# Altium schematic sheet Sheet1.SchDoc
size A4; SheetNumber: 1; SheetTotal: 1
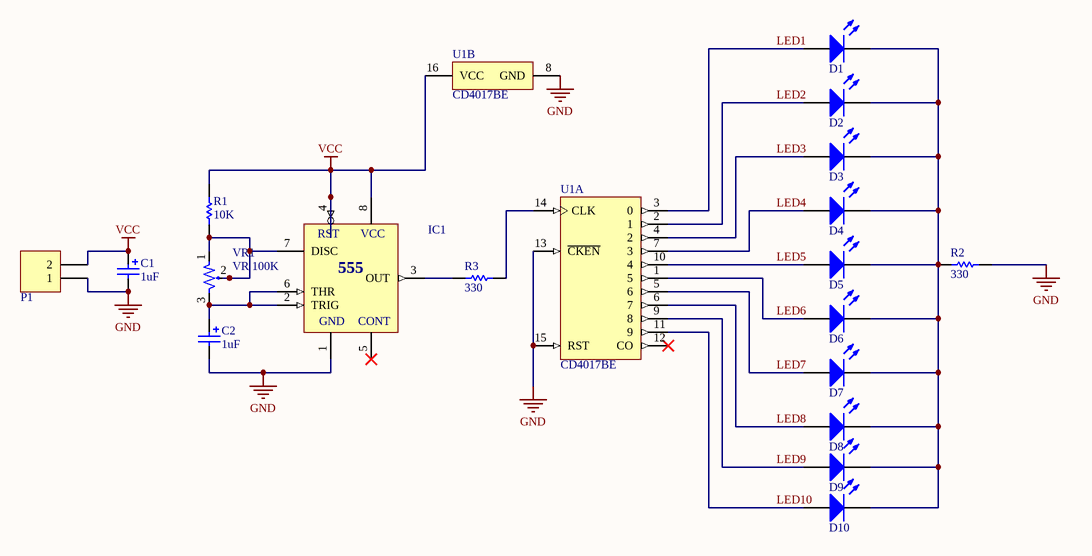
[diagram p0: Sheet1.SchDoc]

## Parts
C1  value 1uF  [CP1/2]  (hidden comment: Cap Pol)
C2  value 1uF  [CP1/2]  (hidden comment: Cap Pol)
D1  LED  [LED-5mm]  (value not drawn)
D2  LED  [LED-5mm]  (value not drawn)
D3  LED  [LED-5mm]  (value not drawn)
D4  LED  [LED-5mm]  (value not drawn)
D5  LED  [LED-5mm]  (value not drawn)
D6  LED  [LED-5mm]  (value not drawn)
D7  LED  [LED-5mm]  (value not drawn)
D8  LED  [LED-5mm]  (value not drawn)
D9  LED  [LED-5mm]  (value not drawn)
D10  LED  [LED-5mm]  (value not drawn)
IC1  LM555  [DIP8/W0.3]  (value not drawn)
P1  Domino 2  [DOMINO 2- 5mm]  (value not drawn)
R1  value 10K  [RES 1/2W]  (hidden comment: RESISTOR)
R2  value 330  [RES 1/2W]  (hidden comment: RESISTOR)
R3  value 330  [RES 1/2W]  (hidden comment: RESISTOR)
U1  CD4017BE  [DIP16/W0.3]  (parts A,B of 2)
VR1  value VR 100K  [Varistor 1]  (hidden comment: 10K)

## Nets
GND: C1.2 C2.2 IC1.1(GND) P1.1 R2.1 U1.8(GND) U1.13(~{CKEN}) U1.15(RST)
VCC: C1.1 IC1.4(RST) IC1.8(VCC) P1.2 R1.2 U1.16(VCC)
LED1: D1.1(A) U1.3(0)
LED2: D2.1(A) U1.2(1)
LED3: D3.1(A) U1.4(2)
LED4: D4.1(A) U1.7(3)
LED5: D5.1(A) U1.10(4)
LED6: D6.1(A) U1.1(5)
LED7: D7.1(A) U1.5(6)
LED8: D8.1(A) U1.6(7)
LED9: D9.1(A) U1.9(8)
LED10: D10.1(A) U1.11(9)
NetC2_1: C2.1 IC1.2(TRIG) IC1.6(THR) VR1.3
NetD1_2: D1.2(K) D2.2(K) D3.2(K) D4.2(K) D5.2(K) D6.2(K) D7.2(K) D8.2(K) D9.2(K) D10.2(K) R2.2
NetIC1_3: IC1.3(OUT) R3.2
NetIC1_7: IC1.7(DISC) R1.1 VR1.1 VR1.2
NetR3_1: R3.1 U1.14(CLK)

Not connected (* = marked no-connect by the designer): IC1 5(CONT)*; U1 12(CO)*

## Notes on the sheet
- (in symbol LM555) 555

## Library data of the parts
C1 C2 = Cap Pol: Polarized Capacitor (Radial)
IC1 = LM555: Timer; Value: LM555
P1 = Domino 2: Domino, 2-Pin; LatestRevisionDate: 17-Jul-2002; LatestRevisionNote: Re-released for DXP Platform.; Publisher: Altium Limited
U1 = CD4017: IC 10-OUT DECADE COUNTER 16-DIP; Mfr: Texas Instruments; Logic Type: Counter, Decade; Direction: Up; Number of Elements: 1; Number of Bits per Element: 10; Reset: Asynchronous; Timing: Synchronous; Count Rate: 5.5 MHz; Trigger Type: Positive Edge; Voltage - Supply: 3 V ~ 18 V; Category: Integrated Circuits (ICs); ComponentLink1Description: thegioiic; ComponentLink1URL: https://www.thegioiic.com/cd40174be-ic-flip-flop-d-type-positive-edge-16mhz-16-dip; Operating Temperature: -55°C ~ 125°C; Mounting Type: Through Hole; Package / Case: 16-DIP (0.300", 7.62mm)
VR1 = Var Resistor